# EAGLE schematic MicroMod_Asset_Tracker (EAGLE 9.6.2)

## Sheet 1 of 2
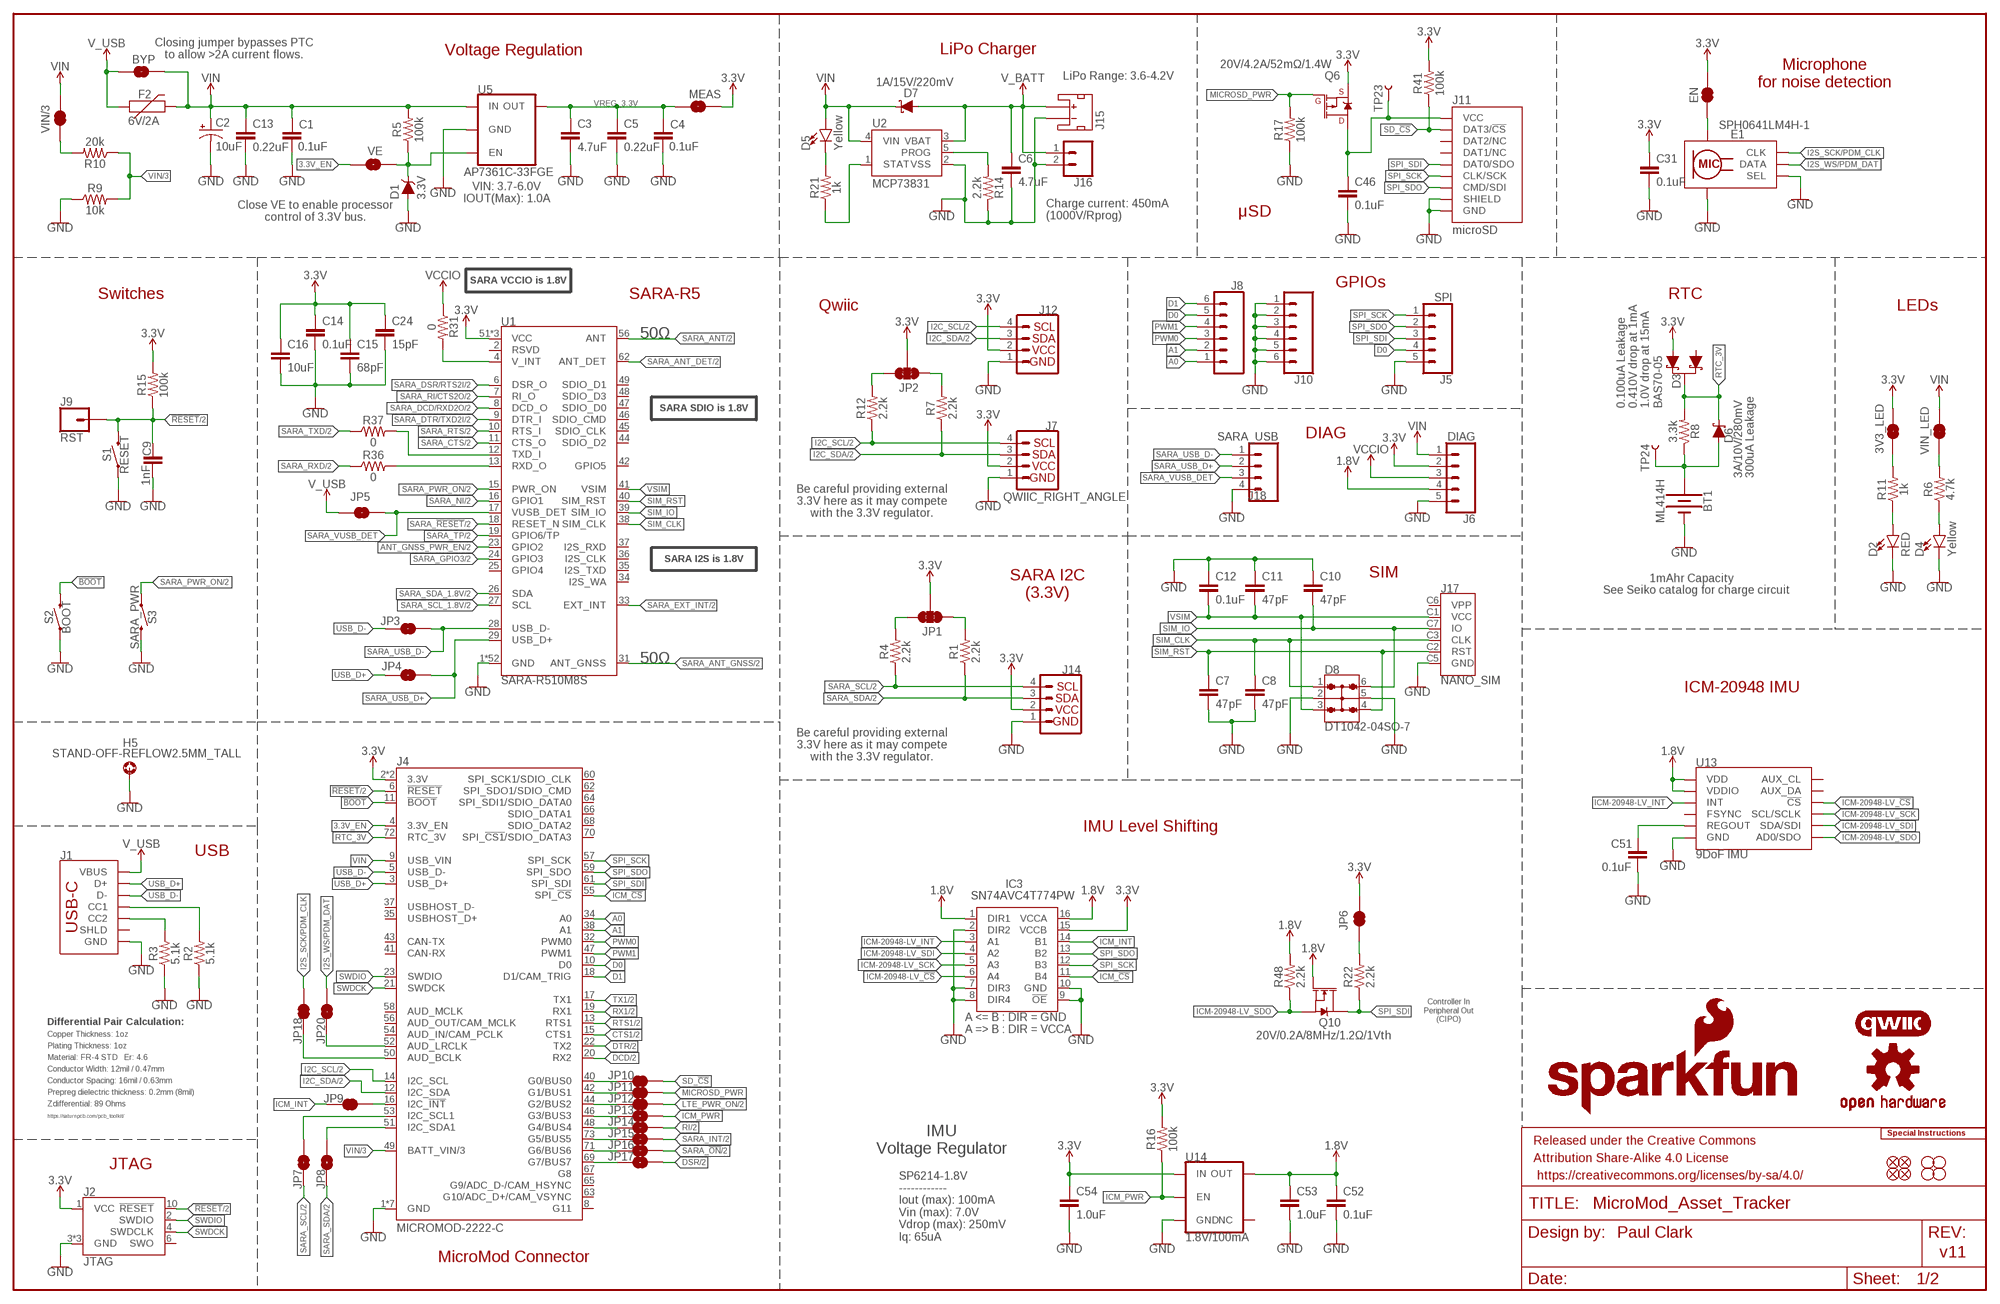
[diagram p0: schematic, sheet 1]

### Parts
3V3_LED  JUMPER-SMT_2_NC_TRACE_SILK  [SMT-JUMPER_2_NC_TRACE_SILK]
BT1  ML414H  ML414H_IV01E_BATTERY  [ML414H_IV01E]
BYP  JUMPER-SMT_2_NO_SILK  [SMT-JUMPER_2_NO_SILK]
C1  0.1uF  0.1UF-0603-25V-(+80/-20%)  [0603]
C2  10uF  10UF-POLAR-EIA3216-16V-10%(TANT)  [EIA3216]
C3  4.7uF  4.7UF-0603-6.3V-(10%)  [0603]
C4  0.1uF  0.1UF-0603-25V-(+80/-20%)  [0603]
C5  0.22uF  0.22UF-0603-25V-10%  [0603]
C6  4.7uF  4.7UF-0603-35V-(20%)  [0603]
C7  47pF  47PF-0603-50V-5%  [0603]
C8  47pF  47PF-0603-50V-5%  [0603]
C9  1nF  1.0NF/1000PF-0603-50V-10%  [0603]
C10  47pF  47PF-0603-50V-5%  [0603]
C11  47pF  47PF-0603-50V-5%  [0603]
C12  0.1uF  0.1UF-0603-25V-5%  [0603]
C13  0.22uF  0.22UF-0603-25V-10%  [0603]
C14  0.1uF  0.1UF-0603-25V-5%  [0603]
C15  68pF  68PF-0603-50V-5%  [0603]
C16  10uF  10UF-0603-6.3V-20%  [0603]
C24  15pF  15PF-0603-50V-5%  [0603]
C31  0.1uF  0.1UF-0603-25V-(+80/-20%)  [0603]
C46  0.1uF  0.1UF-0603-25V-(+80/-20%)  [0603]
C51  0.1uF  0.1UF-0603-25V-5%  [0603]
C52  0.1uF  0.1UF-0603-25V-5%  [0603]
C53  1.0uF  1.0UF-0603-16V-10%-X7R  [0603]
C54  1.0uF  1.0UF-0603-16V-10%-X7R  [0603]
D1  3.3V  DIODE-ZENER-MM3Z3V3T1G  [SOD-323]
D2  RED  LED-RED0603  [LED-0603]
D3  BAS70-05  DIODE-SCHOTTKY-DUAL  [SOT23-3]
D4  Yellow  LED-YELLOW0603  [LED-0603]
D5  Yellow  LED-YELLOW0603  [LED-0603]
D6  3A/10V/280mV  DIODE-SCHOTTKY-BAT60A  [SOD-323]
D7  1A/15V/220mV  DIODE-SCHOTTKY-LSM115JE3  [DO-214BA]
D8  DT1042-04SO-7  TVS_DIODE_ARRAY_4DT1042-04SO-7  [SOT23-6L]
E1  SPH0641LM4H-1  SPH0641LM4H-1_MICROPHONE  [SPH0641LM4H-1_MICROPHONE]
EN  JUMPER-SMT_2_NC_TRACE_SILK  [SMT-JUMPER_2_NC_TRACE_SILK]
F2  6V/2A  PPTC_6V2A  [1210]
FD1  FIDUCIALUFIDUCIAL  [FIDUCIAL-MICRO]
FD2  FIDUCIALUFIDUCIAL  [FIDUCIAL-MICRO]
FD3  FIDUCIALUFIDUCIAL  [FIDUCIAL-MICRO]
FD4  FIDUCIALUFIDUCIAL  [FIDUCIAL-MICRO]
FRAME1  FRAME-LEDGER  [CREATIVE_COMMONS]
H1  STAND-OFF  [STAND-OFF]
H2  STAND-OFF  [STAND-OFF]
H3  STAND-OFF  [STAND-OFF]
H4  STAND-OFF  [STAND-OFF]
H5  STAND-OFF-REFLOW2.5MM_TALL  [STAND-OFF-REFLOW-M2.5]
IC3  SN74AVC4T774PW  [SOP65P640X120-16N]
J1  USB_C_4-LAYER_PADS  [USB-C-16P_4LAYER-PADS]
J2  JTAG  CORTEX_JTAG_DEBUG_MINIMUM_PTH  [2X5-PTH-1.27MM]
J4  MICROMOD-2222-C  [M.2-CONNECTOR-E]
J5  SPI  CONN_05NO_SILK  [1X05_NO_SILK]
J6  DIAG  CONN_05NO_SILK  [1X05_NO_SILK]
J7  QWIIC_RIGHT_ANGLE  QWIIC_CONNECTORJS-1MM  [JST04_1MM_RA]
J8  CONN_06NO_SILK_NO_POP  [1X06_NO_SILK]
J9  !RST!  CONN_01PTH_NO_SILK_YES_STOP  [1X01_NO_SILK]
J10  CONN_06NO_SILK_NO_POP  [1X06_NO_SILK]
J11  microSD  MICRO-SD-SDIOPUSH-PUSH  [MICRO-SD-SOCKET]
J12  I2C_STANDARD_NO_SILK  [1X04_NO_SILK]
J14  I2C_STANDARD_NO_SILK  [1X04_NO_SILK]
J15  JST_2MM_MALE  [JST-2-SMD]
J16  CONN_021X02_NO_SILK  [1X02_NO_SILK]
J17  NANO_SIM  NANO_SIMWURTH  [NANO_SIM_WURTH_693043020611]
J18  SARA_USB  CONN_041X04_NO_SILK  [1X04_NO_SILK]
JP1  JUMPER-SMT_3_2-NC_TRACE_SILK  [SMT-JUMPER_3_2-NC_TRACE_SILK]
JP2  JUMPER-SMT_3_2-NC_TRACE_SILK  [SMT-JUMPER_3_2-NC_TRACE_SILK]
JP3  JUMPER-SMT_2_NO_SILK  [SMT-JUMPER_2_NO_SILK]
JP4  JUMPER-SMT_2_NO_SILK  [SMT-JUMPER_2_NO_SILK]
JP5  JUMPER-SMT_2_NO_SILK  [SMT-JUMPER_2_NO_SILK]
JP6  JUMPER-SMT_2_NC_TRACE_SILK  [SMT-JUMPER_2_NC_TRACE_SILK]
JP7  JUMPER-SMT_2_NO_SILK  [SMT-JUMPER_2_NO_SILK]
JP8  JUMPER-SMT_2_NO_SILK  [SMT-JUMPER_2_NO_SILK]
JP9  JUMPER-SMT_2_NC_TRACE_SILK  [SMT-JUMPER_2_NC_TRACE_SILK]
JP10  JUMPER-SMT_2_NC_TRACE_SILK  [SMT-JUMPER_2_NC_TRACE_SILK]
JP11  JUMPER-SMT_2_NC_TRACE_SILK  [SMT-JUMPER_2_NC_TRACE_SILK]
JP12  JUMPER-SMT_2_NC_TRACE_SILK  [SMT-JUMPER_2_NC_TRACE_SILK]
JP13  JUMPER-SMT_2_NO_SILK  [SMT-JUMPER_2_NO_SILK]
JP14  JUMPER-SMT_2_NO_SILK  [SMT-JUMPER_2_NO_SILK]
JP15  JUMPER-SMT_2_NO_SILK  [SMT-JUMPER_2_NO_SILK]
JP16  JUMPER-SMT_2_NO_SILK  [SMT-JUMPER_2_NO_SILK]
JP17  JUMPER-SMT_2_NO_SILK  [SMT-JUMPER_2_NO_SILK]
JP18  JUMPER-SMT_2_NC_TRACE_SILK  [SMT-JUMPER_2_NC_TRACE_SILK]
JP20  JUMPER-SMT_2_NC_TRACE_SILK  [SMT-JUMPER_2_NC_TRACE_SILK]
LOGO1  SFE_LOGO_NAME_FLAME.1_INCH  [SFE_LOGO_NAME_FLAME_.1]
LOGO2  QWIIC_LOGO_CONNECTOR  [QWIIC_5.5MM]
LOGO3  OSHW-LOGOMINI  [OSHW-LOGO-MINI]
LOGO5  SPECIAL_INSTRUCTIONS-ORDERING  [ORDERING_INSTRUCTIONS]
MEAS  JUMPER-COMBO_2_NC_TRACE  [COMBO-JUMPER_2_NC_TRACE]
Q6  20V/4.2A/52mΩ/1.4W  MOSFET_PCH-DMG2305UX-7  [SOT23-3]
Q10  20V/0.2A/8MHz/1.2Ω/1Vth  MOSFET-NCH-RE1C00UNTL  [SOT-416FL]
R1  2.2k  2.2KOHM-0603-1/10W-1%  [0603]
R2  5.1k  5.1KOHM5.1KOHM-0603-1/10W-1%  [0603]
R3  5.1k  5.1KOHM5.1KOHM-0603-1/10W-1%  [0603]
R4  2.2k  2.2KOHM-0603-1/10W-1%  [0603]
R5  100k  100KOHM-0603-1/10W-1%  [0603]
R6  4.7k  4.7KOHM-0603-1/10W-1%  [0603]
R7  2.2k  2.2KOHM-0603-1/10W-1%  [0603]
R8  3.3k  3.3KOHM-0603-1/10W-1%  [0603]
R9  10k  10KOHM-0603-1/10W-1%  [0603]
R10  20k  20KOHM-0603-1/10W-1%  [0603]
R11  1k  1KOHM-0603-1/10W-1%  [0603]
R12  2.2k  2.2KOHM-0603-1/10W-1%  [0603]
R14  2.2k  2.2KOHM-0603-1/10W-1%  [0603]
R15  100k  100KOHM-0603-1/10W-1%  [0603]
R16  100k  100KOHM-0603-1/10W-1%  [0603]
R17  100k  100KOHM-0603-1/10W-1%  [0603]
R21  1k  1KOHM-0603-1/10W-1%  [0603]
R22  2.2k  2.2KOHM-0603-1/10W-1%  [0603]
R31  0  0OHM-0603-1/10W  [0603]
R36  0  0OHM-0603-1/10W  [0603]
R37  0  0OHM-0603-1/10W  [0603]
R41  100k  100KOHM-0603-1/10W-1%  [0603]
R48  2.2k  2.2KOHM-0603-1/10W-1%  [0603]
S1  RESET  MOMENTARY-SWITCH-SPST-SMD-5.2-TALL-REDUNDANT  [TACTILE_SWITCH_SMD_5.2MM]
S2  BOOT  MOMENTARY-SWITCH-SPST-SMD-5.2-TALL-REDUNDANT  [TACTILE_SWITCH_SMD_5.2MM]
S3  SARA_PWR  MOMENTARY-SWITCH-SPST-SMD-5.2-TALL-REDUNDANT  [TACTILE_SWITCH_SMD_5.2MM]
TP23  TEST-POINT3  [PAD.03X.03]
TP24  TEST-POINT3  [PAD.03X.03]
U1  SARA-R510M8S  [SARA-LGA]
U2  MCP73831  [SOT23-5]
U5  AP7361C-33FGE  AP7361C-33FGEUDFN-8  [UDFN-8]
U13  9DoF IMU  ICM-20948  [QFN24-3X3-ICM-20948]
U14  1.8V/100mA  V_REG_SP6214-1.8V  [SC70]
VE  JUMPER-SMT_2_NO_SILK  [SMT-JUMPER_2_NO_SILK]
VIN/3  JUMPER-SMT_2_NC_TRACE_SILK  [SMT-JUMPER_2_NC_TRACE_SILK]
VIN_LED  JUMPER-SMT_2_NC_TRACE_SILK  [SMT-JUMPER_2_NC_TRACE_SILK]

### Nets
1.8V: C52.1 C53.1 IC3.1(DIR1) IC3.16(VCCA) J6.4 Q10.1(G) R48.2 U13.8(VDDIO) U13.13(VDD) U14.5(OUT)
3.3V: 3V3_LED.2 C14.1 C15.1 C16.1 C24.1 C31.1 C54.1 D3.2(A1) EN.2 IC3.15(VCCB) J2.1(VCC) J4.2(3.3V) J4.74(3.3V) J6.2 J7.2 J12.2 J14.2 JP1.2 JP2.2 JP6.2 MEAS.2 MEAS.4 Q6.2(S) R15.2 R16.2 R41.2 U1.51(VCC) U1.52(VCC) U1.53(VCC) U14.1(IN) ; also sheet 2
3.3V_EN: J4.4(3.3V_EN) VE.1
!BOOT!: J4.11(!BOOT!) S2.3 S2.4
!RESET!: C9.1 J2.10(!RESET) J4.6(!RESET!) J9.1 R15.1 S1.3 S1.4 ; also sheet 2
A0: J4.34(A0) J8.1
A1: J4.38(A1) J8.2
ANT_GNSS_PWR_EN: U1.23(GPIO2) ; also sheet 2
CHG_LED: R21.1 U2.1(STAT)
CTS1: J4.15(CTS1) ; also sheet 2
D0: J4.10(D0) J5.4 J8.5
D1: J4.18(D1/CAM_TRIG) J8.6
DCD: J4.20(RX2) ; also sheet 2
DSR: JP17.2 ; also sheet 2
DTR: J4.22(TX2) ; also sheet 2
G0: J4.40(G0/BUS0) JP10.1
G1: J4.42(G1/BUS1) JP11.1
G2: J4.44(G2/BUS2) JP12.1
G3: J4.46(G3/BUS3) JP13.1
G4: J4.48(G4/BUS4) JP14.1
G5: J4.73(G5/BUS5) JP15.1
G6: J4.71(G6/BUS6) JP16.1
G7: J4.69(G7/BUS7) JP17.1
GND: BT1.- C1.2 C2.- C3.2 C4.2 C5.2 C6.2 C7.2 C8.2 C9.2 C10.1 C11.1 C12.1 C13.2 C14.2 C15.2 C16.2 C24.2 C31.2 C46.2 C51.2 C52.2 C53.2 C54.2 D1.A D2.C D4.C D8.2 D8.5 E1.2(SEL) E1.3(GND) E1.6(GND) E1.7(GND) E1.8(GND) H5.1 IC3.2(DIR2) IC3.7(DIR3) IC3.8(DIR4) IC3.9(!OE) IC3.10(GND) J1.GND J1.GND2(GND) J2.3(GND) J2.5(GND) J2.9(GND) J4.1(GND) J4.7(GND) J4.33(GND) J4.36(GND) J4.39(GND) J4.45(GND) J4.75(GND) J5.5 J6.5 J7.1 J10.1 J10.2 J10.3 J10.4 J10.5 J10.6 J11.CD1(SHIELD) J11.GND J11.GND1(GND) J11.GND3(GND) J12.1 J14.1 J15.1(-) J16.2 J17.C5(GND) J18.4 R2.1 R3.1 R9.1 R14.1 R17.1 S1.1 S1.2 S2.1 S2.2 S3.3 S3.4 U1.1(GND) U1.3(GND) U1.5(GND) U1.14(GND) U1.20(GND) U1.21(GND) U1.22(GND) U1.30(GND) U1.32(GND) U1.43(GND) U1.50(GND) U1.54(GND) U1.55(GND) U1.57(GND) U1.58(GND) U1.59(GND) U1.60(GND) U1.61(GND) U1.63(GND) U1.64(GND) U1.65(GND) U1.66(GND) U1.67(GND) U1.68(GND) U1.69(GND) U1.70(GND) U1.71(GND) U1.72(GND) U1.73(GND) U1.74(GND) U1.75(GND) U1.76(GND) U1.77(GND) U1.78(GND) U1.79(GND) U1.80(GND) U1.81(GND) U1.82(GND) U1.83(GND) U1.84(GND) U1.85(GND) U1.86(GND) U1.87(GND) U1.88(GND) U1.89(GND) U1.90(GND) U1.91(GND) U1.92(GND) U1.93(GND) U1.94(GND) U1.95(GND) U1.96(GND) U2.2(VSS) U5.4(GND) U5.EP(GND) U13.18(GND) U13.20(GND) U14.2(GND) ; also sheet 2
I2C_SCL: J4.14(I2C_SCL) J7.4 J12.4 R12.1 ; also sheet 2
I2C_SDA: J4.12(I2C_SDA) J7.3 J12.3 R7.1 ; also sheet 2
I2S_SCK/PDM_CLK: E1.4(CLK) JP18.2
I2S_WS/PDM_DAT: E1.1(DATA) JP20.2
ICM-20948-LV_!CS!: IC3.6(A4) U13.22(!CS)
ICM-20948-LV_INT: IC3.3(A1) U13.12(INT)
ICM-20948-LV_SCK: IC3.5(A3) U13.23(SCL/SCLK)
ICM-20948-LV_SDI: IC3.4(A2) U13.24(SDA/SDI)
ICM-20948-LV_SDO: Q10.2(S) R48.1 U13.9(AD0/SDO)
ICM_!CS!: IC3.11(B4) J4.55(SPI_!CS!)
ICM_INT: IC3.14(B1) JP9.1
ICM_PWR: JP13.2 R16.1 U14.3(EN)
LTE_PWR_ON: JP12.2 ; also sheet 2
MICROSD_PWR: JP11.2 Q6.1(G) R17.2
N$1: R6.2 VIN_LED.1
N$2: JP1.3 R4.2
N$3: JP1.1 R1.2
N$4: E1.5(VDD) EN.1
N$5: J4.53(I2C_SCL1) JP7.2
N$6: 3V3_LED.1 R11.2
N$7: D2.A R11.1
N$8: D4.A R6.1
N$9: JP2.3 R12.2
N$10: J1.A5(CC1) R2.2
N$11: J1.B5(CC2) R3.2
N$12: D1.C R5.1 U5.5(EN) VE.2
N$13: JP2.1 R7.2
N$14: BT1.+ D6.A R8.1 TP24.P$1
N$17: J4.51(I2C_SDA1) JP8.2
N$18: R10.2 VIN/3.1
N$19: J4.16(I2C_!INT!) JP9.2
N$20: R14.2 U2.5(PROG)
N$21: D5.C R21.2
N$29: JP6.1 R22.2
N$30: C51.1 U13.10(REGOUT)
N$31: R31.2 U1.4(V_INT)
N$38: R36.2 U1.13(RXD_O)
N$39: R37.2 U1.12(TXD_I)
N$51: J4.52(AUD_LRCLK) JP20.1
N$52: J4.50(AUD_BCLK) JP18.1
PWM0: J4.32(PWM0) J8.3
PWM1: J4.47(PWM1) J8.4
RI: JP14.2 ; also sheet 2
RTC_3V: D3.3(C) D6.C J4.72(RTC_3V) R8.2
RTS1: J4.13(RTS1) ; also sheet 2
RX1: J4.19(RX1) ; also sheet 2
SARA_!ON!: JP16.2 ; also sheet 2
SARA_!RESET!: U1.18(RESET_N) ; also sheet 2
SARA_ANT: U1.56(ANT) ; also sheet 2
SARA_ANT_DET: U1.62(ANT_DET) ; also sheet 2
SARA_ANT_GNSS: U1.31(ANT_GNSS) ; also sheet 2
SARA_CTS: U1.11(CTS_O) ; also sheet 2
SARA_DCD/RXD2O: U1.8(DCD_O) ; also sheet 2
SARA_DSR/RTS2I: U1.6(DSR_O) ; also sheet 2
SARA_DTR/TXD2I: U1.9(DTR_I) ; also sheet 2
SARA_EXT_INT: U1.33(EXT_INT) ; also sheet 2
SARA_GPIO3: U1.24(GPIO3) ; also sheet 2
SARA_INT: JP15.2 ; also sheet 2
SARA_NI: U1.16(GPIO1) ; also sheet 2
SARA_PWR_ON: S3.1 S3.2 U1.15(PWR_ON) ; also sheet 2
SARA_RI/CTS2O: U1.7(RI_O) ; also sheet 2
SARA_RTS: U1.10(RTS_I) ; also sheet 2
SARA_RXD: R36.1 ; also sheet 2
SARA_SCL: J14.4 JP7.1 R4.1 ; also sheet 2
SARA_SCL_1.8V: U1.27(SCL) ; also sheet 2
SARA_SDA: J14.3 JP8.1 R1.1 ; also sheet 2
SARA_SDA_1.8V: U1.26(SDA) ; also sheet 2
SARA_TP: U1.19(GPIO6/TP) ; also sheet 2
SARA_TXD: R37.1 ; also sheet 2
SARA_USB_D+: J18.2 JP4.2 U1.29(USB_D+)
SARA_USB_D-: J18.1 JP3.2 U1.28(USB_D-)
SARA_VUSB_DET: J18.3 JP5.2 U1.17(VUSB_DET)
SD_!CS!: J11.CS/DAT3(DAT3/!CS!) JP10.2 R41.1
SD_PWR: C46.1 J11.VCC Q6.3(D) TP23.P$1
SIM_CLK: C8.1 D8.1 J17.C3(CLK) U1.38(SIM_CLK)
SIM_IO: C10.2 D8.6 J17.C7(IO) U1.39(SIM_IO)
SIM_RST: C7.1 D8.4 J17.C2(RST) U1.40(SIM_RST)
SPI_SCK: IC3.12(B3) J4.57(SPI_SCK) J5.1 J11.SCLK(CLK/SCK)
SPI_SDI: J4.61(SPI_SDI) J5.3 J11.DO/DAT0(DAT0/SDO) Q10.3(D) R22.1
SPI_SDO: IC3.13(B2) J4.59(SPI_SDO) J5.2 J11.DI/CMD(CMD/SDI)
SWDCK: J2.4(SWDCLK) J4.21(SWDCK)
SWDIO: J2.2(SWDIO) J4.23(SWDIO)
TX1: J4.17(TX1) ; also sheet 2
USB_D+: J1.A6(D+) J1.B6(D+) J4.3(USB_D+) JP4.1
USB_D-: J1.A7(D-) J1.B7(D-) J4.5(USB_D-) JP3.1
V_BATT: C6.1 D7.A J15.2(+) J16.1 U2.3(VBAT) ; also sheet 2
V_USB: BYP.1 F2.1 J1.VBUS1(VBUS) J1.VBUS2(VBUS) JP5.1
VCCIO: J6.3 R31.1 ; also sheet 2
VIN: BYP.2 C1.1 C2.+ C13.1 D5.A D7.C F2.2 J4.9(USB_VIN) J6.1 R5.2 U2.4(VIN) U5.8(IN) VIN/3.2 VIN_LED.2 ; also sheet 2
VIN/3: J4.49(BATT_VIN/3) R9.2 R10.1
VREG_3.3V: C3.1 C4.1 C5.1 MEAS.1 MEAS.3 U5.1(OUT)
VSIM: C11.2 C12.2 D8.3 J17.C1(VCC) U1.41(VSIM)
Unconnected: D3.1(A) J1.SHLD1(SHLD) J1.SHLD2(SHLD) J1.SHLD3(SHLD) J1.SHLD4(SHLD) J2.6(SWO) J4.8(G11) J4.35(USBHOST_D+) J4.37(USBHOST_D-) J4.41(CAN-RX) J4.43(CAN-TX) J4.54(AUD_IN/CAM_PCLK) J4.56(AUD_OUT/CAM_MCLK) J4.58(AUD_MCLK) J4.60(SPI_SCK1/SDIO_CLK) J4.62(SPI_SDO1/SDIO_CMD) J4.63(G10/ADC_D+/CAM_VSYNC) J4.64(SPI_SDI1/SDIO_DATA0) J4.65(G9/ADC_D-/CAM_HSYNC) J4.66(SDIO_DATA1) J4.67(G8) J4.68(SDIO_DATA2) J4.70(SPI_!CS1!/SDIO_DATA3) J11.DAT1(DAT1/NC) J11.DAT2(DAT2/NC) J15.NC1(PAD1) J15.NC2(PAD2) J17.C6(VPP) U1.2(RSVD) U1.25(GPIO4) U1.34(I2S_WA) U1.35(I2S_TXD) U1.36(I2S_CLK) U1.37(I2S_RXD) U1.42(GPIO5) U1.44(SDIO_D2) U1.45(SDIO_CLK) U1.46(SDIO_CMD) U1.47(SDIO_D0) U1.48(SDIO_D3) U1.49(SDIO_D1) U13.7(AUX_CL) U13.11(FSYNC) U13.21(AUX_DA) U14.4(NC)

### Notes on the sheet
- Closing jumper bypasses PTC
  to allow >2A current flows.
- Voltage Regulation | LiPo Charger
- LiPo Range: 3.6-4.2V
- Microphone
  for noise detection
- VIN: 3.7-6.0V
  IOUT(Max): 1.0A
- Charge current: 450mA
  (1000V/Rprog)
- Close VE to enable processor
  control of 3.3V bus.
- μSD
- SARA VCCIO is 1.8V
- GPIOs
- Switches | SARA-R5 | RTC
- Qwiic | LEDs
- 50Ω
- SARA SDIO is 1.8V
- 0.100uA Leakage
  0.410V drop at 1mA
  1.0V drop at 15mA
- DIAG
- 300uA Leakage
- Be careful providing external
  3.3V here as it may compete
  with the 3.3V regulator.
- SARA I2S is 1.8V
- SIM
- 1mAhr Capacity
- SARA I2C
  (3.3V)
- See Seiko catalog for charge circuit
- 50Ω
- ICM-20948 IMU
- Be careful providing external
  3.3V here as it may compete
  with the 3.3V regulator.
- IMU Level Shifting
- USB
- Controller In
  Peripheral Out
  (CIPO)
- Differential Pair Calculation:
- Copper Thickness: 1oz
- Plating Thickness: 1oz
- Material: FR-4 STD   Er: 4.6
- Conductor Width: 12mil / 0.47mm
- Conductor Spacing: 16mil / 0.63mm
- Prepreg dielectric thickness: 0.2mm (8mil)
- Zdifferential: 89 Ohms
- https://saturnpcb.com/pcb_toolkit/
- IMU
  Voltage Regulator
- JTAG
- SP6214-1.8V
  ------------
  Iout (max): 100mA 
  Vin (max): 7.0V
  Vdrop (max): 250mV
  Iq: 65uA
- Paul Clark
- MicroMod Connector | v11

## Sheet 2 of 2
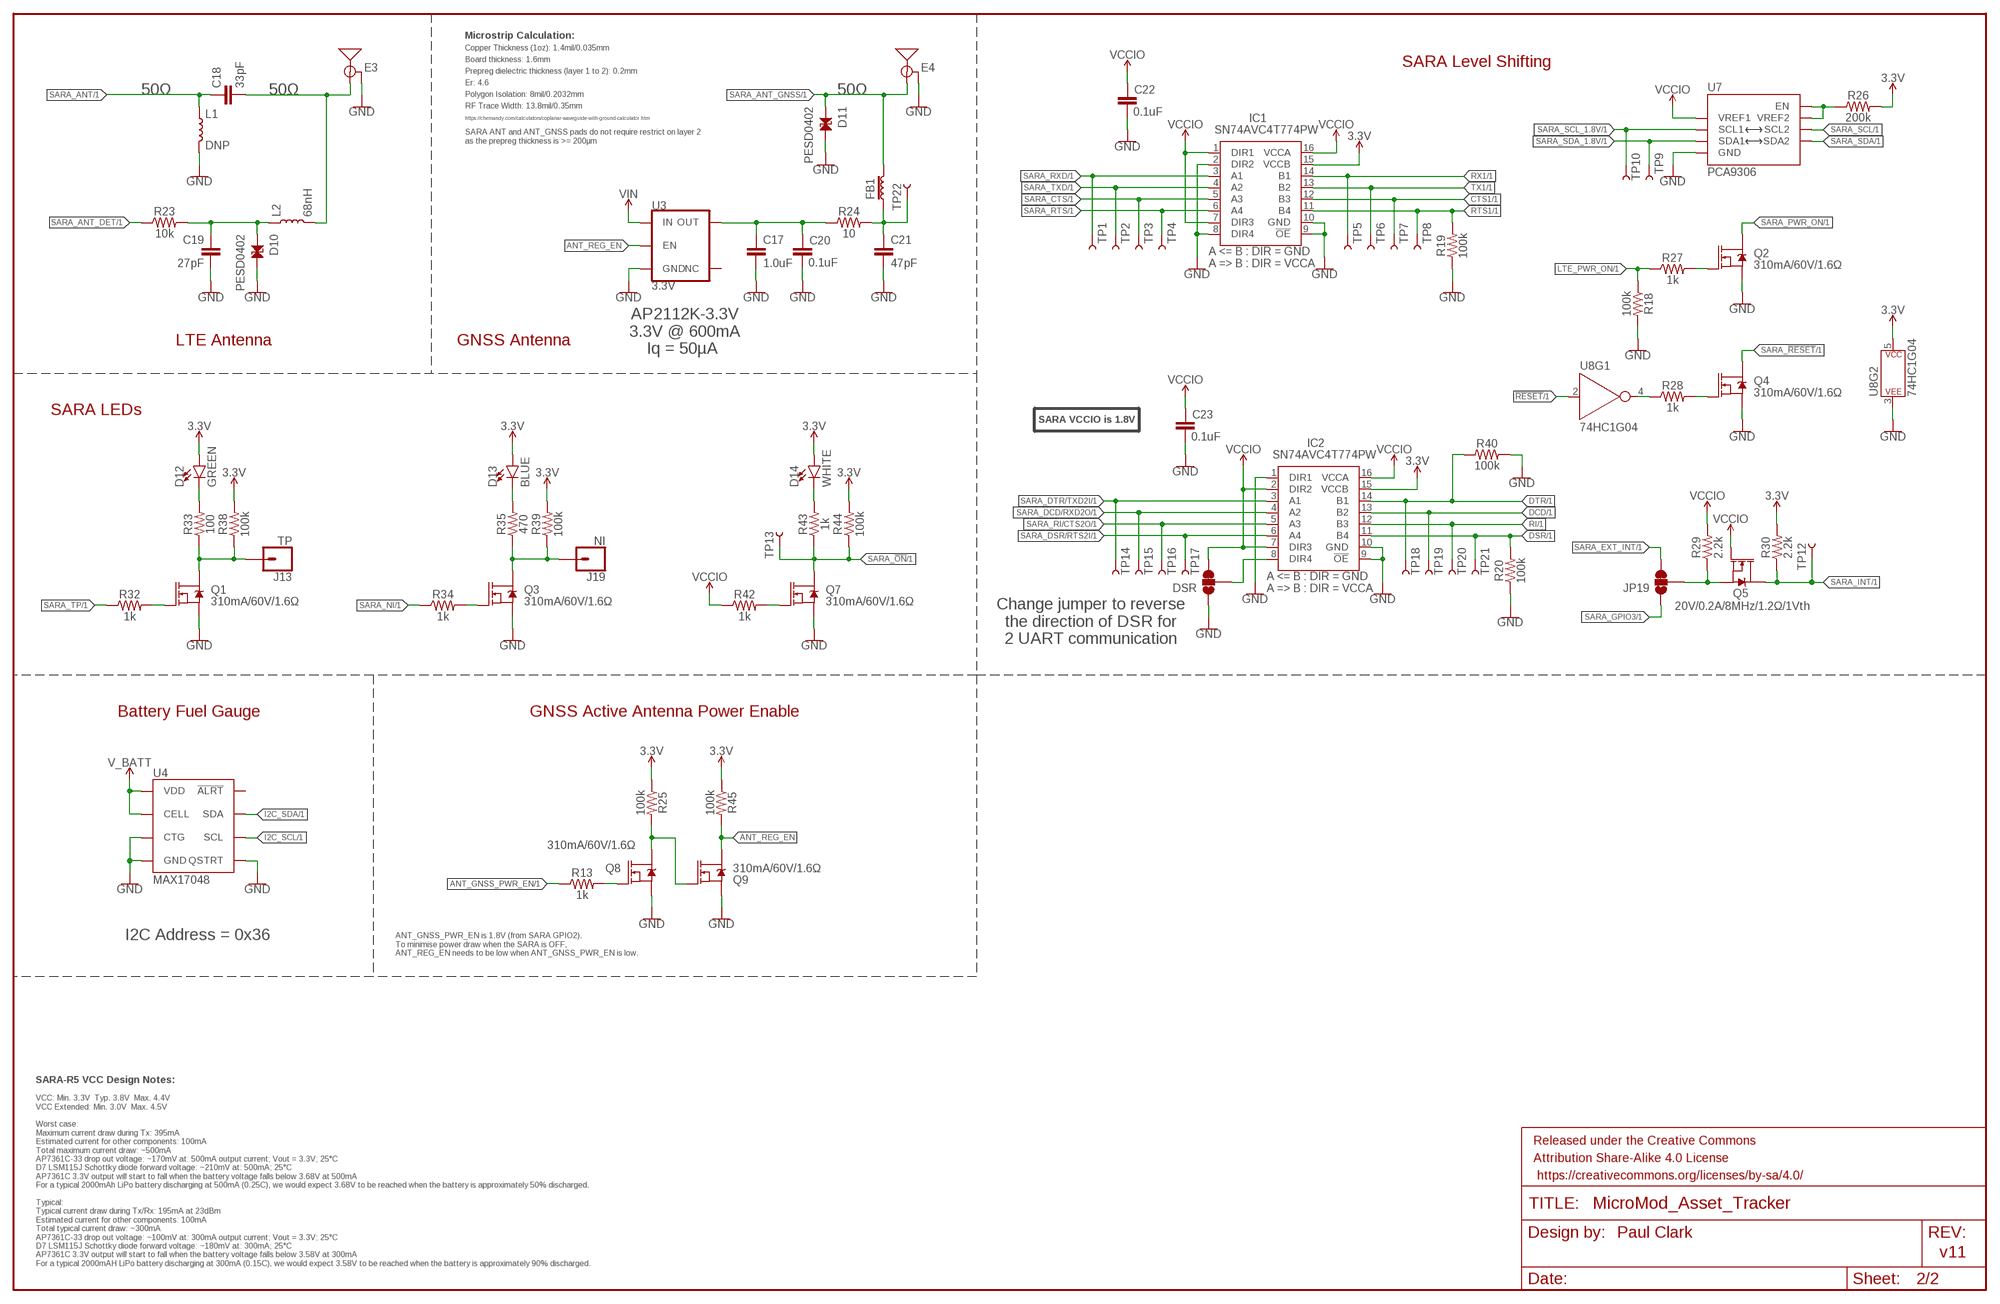
[diagram p1: schematic, sheet 2]

### Parts
C17  1.0uF  1.0UF-0603-16V-10%  [0603]
C18  33pF  33PF-0402-25V-5%-X7R  [0402]
C19  27pF  27PF-0402-25V-5%-X7R  [0402]
C20  0.1uF  0.1UF-0603-25V-(+80/-20%)  [0603]
C21  47pF  47PF-0603-50V-5%  [0603]
C22  0.1uF  0.1UF-0603-25V-(+80/-20%)  [0603]
C23  0.1uF  0.1UF-0603-25V-(+80/-20%)  [0603]
D10  PESD0402  [0402]
D11  PESD0402  [0402]
D12  GREEN  LED-GREEN0603  [LED-0603]
D13  BLUE  LED-BLUE0603  [LED-0603]
D14  WHITE  LED-WHITE0603  [LED-0603]
DSR  JUMPER-SMT_3_1-NC_TRACE_SILK  [SMT-JUMPER_3_1-NC_TRACE_SILK]
E3  ANTENNA-SMA-GROUNDEDEDGE_SMA_SMD  [SMA-EDGE-SMD]
E4  ANTENNA-SMA-GROUNDEDEDGE_SMA_SMD  [SMA-EDGE-SMD]
FB1  30Ω/1.8A  FERRITE_BEAD-0603  [0603]
FRAME2  FRAME-LEDGER  [CREATIVE_COMMONS]
IC1  SN74AVC4T774PW  [SOP65P640X120-16N]
IC2  SN74AVC4T774PW  [SOP65P640X120-16N]
J13  TP  CONN_01PTH_NO_SILK_YES_STOP  [1X01_NO_SILK]
J19  NI  CONN_01PTH_NO_SILK_YES_STOP  [1X01_NO_SILK]
JP19  JUMPER-SMT_3_1-NC_TRACE_SILK  [SMT-JUMPER_3_1-NC_TRACE_SILK]
L1  DNP  INDUCTOR_DNP-0402  [0402_COILCRAFT]
L2  68nH  68NH-0402  [0402_COILCRAFT]
Q1  310mA/60V/1.6Ω  MOSFET-NCH-2N7002PW  [SOT323]
Q2  310mA/60V/1.6Ω  MOSFET-NCH-2N7002PW  [SOT323]
Q3  310mA/60V/1.6Ω  MOSFET-NCH-2N7002PW  [SOT323]
Q4  310mA/60V/1.6Ω  MOSFET-NCH-2N7002PW  [SOT323]
Q5  20V/0.2A/8MHz/1.2Ω/1Vth  MOSFET-NCH-RE1C00UNTL  [SOT-416FL]
Q7  310mA/60V/1.6Ω  MOSFET-NCH-2N7002PW  [SOT323]
Q8  310mA/60V/1.6Ω  MOSFET-NCH-2N7002PW  [SOT323]
Q9  310mA/60V/1.6Ω  MOSFET-NCH-2N7002PW  [SOT323]
R13  1k  1KOHM-0603-1/10W-1%  [0603]
R18  100k  100KOHM-0603-1/10W-1%  [0603]
R19  100k  100KOHM-0603-1/10W-1%  [0603]
R20  100k  100KOHM-0603-1/10W-1%  [0603]
R23  10k  10KOHM-0603-1/10W-1%  [0603]
R24  10  10OHM-0603-1/10W-1%  [0603]
R25  100k  100KOHM-0603-1/10W-1%  [0603]
R26  200k  200KOHM-0603-1/10W-1%  [0603]
R27  1k  1KOHM-0603-1/10W-1%  [0603]
R28  1k  1KOHM-0603-1/10W-1%  [0603]
R29  2.2k  2.2KOHM-0603-1/10W-1%  [0603]
R30  2.2k  2.2KOHM-0603-1/10W-1%  [0603]
R32  1k  1KOHM-0603-1/10W-1%  [0603]
R33  100  100OHM-0603-1/10W-1%  [0603]
R34  1k  1KOHM-0603-1/10W-1%  [0603]
R35  470  470OHM-0603-1/10W-1%  [0603]
R38  100k  100KOHM-0603-1/10W-1%  [0603]
R39  100k  100KOHM-0603-1/10W-1%  [0603]
R40  100k  100KOHM-0603-1/10W-1%  [0603]
R42  1k  1KOHM-0603-1/10W-1%  [0603]
R43  1k  1KOHM-0603-1/10W-1%  [0603]
R44  100k  100KOHM-0603-1/10W-1%  [0603]
R45  100k  100KOHM-0603-1/10W-1%  [0603]
TP1  TEST-POINT3  [PAD.03X.03]
TP2  TEST-POINT3  [PAD.03X.03]
TP3  TEST-POINT3  [PAD.03X.03]
TP4  TEST-POINT3  [PAD.03X.03]
TP5  TEST-POINT3  [PAD.03X.03]
TP6  TEST-POINT3  [PAD.03X.03]
TP7  TEST-POINT3  [PAD.03X.03]
TP8  TEST-POINT3  [PAD.03X.03]
TP9  TEST-POINT3  [PAD.03X.03]
TP10  TEST-POINT3  [PAD.03X.03]
TP12  TEST-POINT3  [PAD.03X.03]
TP13  TEST-POINT3  [PAD.03X.03]
TP14  TEST-POINT3  [PAD.03X.03]
TP15  TEST-POINT3  [PAD.03X.03]
TP16  TEST-POINT3  [PAD.03X.03]
TP17  TEST-POINT3  [PAD.03X.03]
TP18  TEST-POINT3  [PAD.03X.03]
TP19  TEST-POINT3  [PAD.03X.03]
TP20  TEST-POINT3  [PAD.03X.03]
TP21  TEST-POINT3  [PAD.03X.03]
TP22  TEST-POINT3  [PAD.03X.03]
U3  3.3V  V_REG_AP2112K-3.3V  [SOT23-5]
U4  MAX17048  MAX17048DFN8  [DFN-8]
U7  PCA9306  PCA9306VSSOP_8PIN  [VSSOP_8PIN]
U8  74HC1G04  [SOT353]

### Nets
3.3V: D12.A D13.A D14.A IC1.15(VCCB) IC2.15(VCCB) R25.1 R26.2 R30.2 R38.2 R39.2 R44.2 R45.1 U8.5(P$V+) ; also sheet 1
!RESET!: U8.2(A) ; also sheet 1
ANT_GNSS_PWR_EN: R13.1 ; also sheet 1
ANT_REG_EN: Q9.3(D) R45.2 U3.3(EN)
CTS1: IC1.12(B3) TP7.P$1 ; also sheet 1
DCD: IC2.13(B2) TP19.P$1 ; also sheet 1
DSR: IC2.11(B4) R20.2 TP21.P$1 ; also sheet 1
DTR: IC2.14(B1) R40.1 TP18.P$1 ; also sheet 1
GND: C17.2 C19.2 C20.2 C21.2 C22.2 C23.2 D10.2 D11.2 DSR.1 E3.GND@0(GND) E3.GND@1(GND) E4.GND@0(GND) E4.GND@1(GND) IC1.2(DIR2) IC1.8(DIR4) IC1.9(!OE) IC1.10(GND) IC2.1(DIR1) IC2.9(!OE) IC2.10(GND) L1.P$2 Q1.2(S) Q2.2(S) Q3.2(S) Q4.2(S) Q7.2(S) Q8.2(S) Q9.2(S) R18.2 R19.1 R20.1 R40.2 U3.2(GND) U4.1(CTG) U4.4(GND) U4.6(QSTRT) U4.9(GND) U7.P1(GND) U8.3(P$V-) ; also sheet 1
I2C_SCL: U4.7(SCL) ; also sheet 1
I2C_SDA: U4.8(SDA) ; also sheet 1
LTE_PWR_ON: R18.1 R27.1 ; also sheet 1
N$15: C18.2 E3.SIG(SIGNAL) L2.P$2
N$16: C19.1 D10.1 L2.P$1 R23.2
N$22: R26.1 U7.P7(VREF2) U7.P8(EN)
N$23: DSR.2 IC2.8(DIR4)
N$24: C17.1 C20.1 R24.1 U3.5(OUT)
N$25: C21.1 FB1.1 R24.2 TP22.P$1
N$26: Q2.1(G) R27.2
N$27: Q4.1(G) R28.2
N$28: R28.1 U8.4(Y)
N$32: Q1.1(G) R32.2
N$33: J13.1 Q1.3(D) R33.1 R38.1
N$34: D12.C R33.2
N$35: Q3.1(G) R34.2
N$36: J19.1 Q3.3(D) R35.1 R39.1
N$37: D13.C R35.2
N$40: Q8.1(G) R13.2
N$42: Q8.3(D) Q9.1(G) R25.2
N$43: JP19.2 Q5.2(S) R29.1
N$47: Q7.1(G) R42.2
N$49: D14.C R43.2
RI: IC2.12(B3) TP20.P$1 ; also sheet 1
RTS1: IC1.11(B4) R19.2 TP8.P$1 ; also sheet 1
RX1: IC1.14(B1) TP5.P$1 ; also sheet 1
SARA_!ON!: Q7.3(D) R43.1 R44.1 TP13.P$1 ; also sheet 1
SARA_!RESET!: Q4.3(D) ; also sheet 1
SARA_ANT: C18.1 L1.P$1 ; also sheet 1
SARA_ANT_DET: R23.1 ; also sheet 1
SARA_ANT_GNSS: D11.1 E4.SIG(SIGNAL) FB1.2 ; also sheet 1
SARA_CTS: IC1.5(A3) TP3.P$1 ; also sheet 1
SARA_DCD/RXD2O: IC2.4(A2) TP15.P$1 ; also sheet 1
SARA_DSR/RTS2I: IC2.6(A4) TP17.P$1 ; also sheet 1
SARA_DTR/TXD2I: IC2.3(A1) TP14.P$1 ; also sheet 1
SARA_EXT_INT: JP19.3 ; also sheet 1
SARA_GPIO3: JP19.1 ; also sheet 1
SARA_INT: Q5.3(D) R30.1 TP12.P$1 ; also sheet 1
SARA_NI: R34.1 ; also sheet 1
SARA_PWR_ON: Q2.3(D) ; also sheet 1
SARA_RI/CTS2O: IC2.5(A3) TP16.P$1 ; also sheet 1
SARA_RTS: IC1.6(A4) TP4.P$1 ; also sheet 1
SARA_RXD: IC1.3(A1) TP1.P$1 ; also sheet 1
SARA_SCL: U7.P6(SCL2) ; also sheet 1
SARA_SCL_1.8V: TP10.P$1 U7.P3(SCL1) ; also sheet 1
SARA_SDA: U7.P5(SDA2) ; also sheet 1
SARA_SDA_1.8V: TP9.P$1 U7.P4(SDA1) ; also sheet 1
SARA_TP: R32.1 ; also sheet 1
SARA_TXD: IC1.4(A2) TP2.P$1 ; also sheet 1
TX1: IC1.13(B2) TP6.P$1 ; also sheet 1
V_BATT: U4.2(CELL) U4.3(VDD) ; also sheet 1
VCCIO: C22.1 C23.1 DSR.3 IC1.1(DIR1) IC1.7(DIR3) IC1.16(VCCA) IC2.2(DIR2) IC2.7(DIR3) IC2.16(VCCA) Q5.1(G) R29.2 R42.1 U7.P2(VREF1) ; also sheet 1
VIN: U3.1(IN) ; also sheet 1
Unconnected: U3.4(NC) U4.5(!ALRT)

### Notes on the sheet
- Microstrip Calculation:
- Copper Thickness (1oz): 1.4mil/0.035mm
- Board thickness: 1.6mm | SARA Level Shifting
- Prepreg dielectric thickness (layer 1 to 2): 0.2mm
- Er: 4.6
- 50Ω | 50Ω | Polygon Isolation: 8mil/0.2032mm | 50Ω
- RF Trace Width: 13.8mil/0.35mm
- https://chemandy.com/calculators/coplanar-waveguide-with-ground-calculator.htm
- SARA ANT and ANT_GNSS pads do not require restrict on layer 2
  as the prepreg thickness is >= 200µm
- AP2112K-3.3V
  3.3V @ 600mA
  Iq = 50µA
- LTE Antenna | GNSS Antenna
- SARA LEDs
- SARA VCCIO is 1.8V
- Change jumper to reverse
  the direction of DSR for
  2 UART communication
- Battery Fuel Gauge | GNSS Active Antenna Power Enable
- I2C Address = 0x36
- ANT_GNSS_PWR_EN is 1.8V (from SARA GPIO2).
  To minimise power draw when the SARA is OFF,
  ANT_REG_EN needs to be low when ANT_GNSS_PWR_EN is low.
- SARA-R5 VCC Design Notes:
- VCC: Min. 3.3V  Typ. 3.8V  Max. 4.4V
  VCC Extended: Min. 3.0V  Max. 4.5V
  
  Worst case:
  Maximum current draw during Tx: 395mA
  Estimated current for other components: 100mA
  Total maximum current draw: ~500mA
  AP7361C-33 drop out voltage: ~170mV at: 500mA output current; Vout = 3.3V; 25°C
  D7 LSM115J Schottky diode forward voltage: ~210mV at: 500mA; 25°C
  AP7361C 3.3V output will start to fall when the battery voltage falls below 3.68V at 500mA
  For a typical 2000mAh LiPo battery discharging at 500mA (0.25C), we would expect 3.68V to be reached when the battery is approximately 50% discharged.
  
  Typical:
  Typical current draw during Tx/Rx: 195mA at 23dBm
  Estimated current for other components: 100mA
  Total typical current draw: ~300mA
  AP7361C-33 drop out voltage: ~100mV at: 300mA output current; Vout = 3.3V; 25°C
  D7 LSM115J Schottky diode forward voltage: ~180mV at: 300mA; 25°C
  AP7361C 3.3V output will start to fall when the battery voltage falls below 3.58V at 300mA
  For a typical 2000mAH LiPo battery discharging at 300mA (0.15C), we would expect 3.58V to be reached when the battery is approximately 90% discharged.
- Paul Clark
- v11

## Library data of the parts
3V3_LED EN JP6 JP9-JP12 JP18 JP20 VIN/3 VIN_LED = SparkFun-Jumpers:JUMPER-SMT_2_NC_TRACE: Normally closed trace jumper This jumper has a trace between two pads so it's normally closed (NC). Use a razor knife to open the connection. For best results follow the IPC guidelines for cutting traces: Cutout at least 0.063 mm (0.005 in). Remove all loose material to clean up the cut area. Seal the cut with an approved epoxy. Reapply solder to reclose the connection.
BT1 = SparkFun-Batteries:ML414H_IV01E_BATTERY: SEIKO ML414H-IV01E Reflowable Lithium Battery ML414H is a rechargeable, coin type battery with features such as Pb-free reflowable (Peak temperature: 260 C) and high temperature heat resistance. Battery Characteristics: 3.1V max voltage Voff is 2V 1mAH 3k series resistor with battery 72 hour charge time from 2.0-3.1V 2.3-2.8V initial charge; PROD_ID: BATT-14267
BYP JP3-JP5 JP7 JP8 JP13-JP17 VE = SparkFun-Jumpers:JUMPER-SMT_2_NO: Normally open jumper This jumper has two pads in close proximity to each other. Apply solder to close the connection. Round pads are easier to solder for beginners, but are a lot larger. SparkFun Product that uses the round pads: SparkFun EL Sequencer <https://www.sparkfun.com/products/12781>
C1 C4 C20 C22 C23 C31 C46 = SparkFun-Capacitors:0.1UF: 0.1µF ceramic capacitors A capacitor is a passive two-terminal electrical component used to store electrical energy temporarily in an electric field.; PROD_ID: CAP-00810
C2 = SparkFun-Capacitors:10UF-POLAR: 10.0µF polarized capacitors A capacitor is a passive two-terminal electrical component used to store electrical energy temporarily in an electric field.; PROD_ID: CAP-00811
C3 = SparkFun-Capacitors:4.7UF: 4.7µF ceramic capacitors A capacitor is a passive two-terminal electrical component used to store electrical energy temporarily in an electric field.; PROD_ID: CAP-08280
C5 C13 = SparkFun-Capacitors:0.22UF: 0.22µF ceramic capacitors A capacitor is a passive two-terminal electrical component used to store electrical energy temporarily in an electric field.; PROD_ID: CAP-07822
C6 = SparkFun-Capacitors:4.7UF: 4.7µF ceramic capacitors A capacitor is a passive two-terminal electrical component used to store electrical energy temporarily in an electric field.; PROD_ID: CAP-14106
C7 C8 C10 C11 C21 = SparkFun-Capacitors:47PF: 47pF ceramic capacitors A capacitor is a passive two-terminal electrical component used to store electrical energy temporarily in an electric field.; PROD_ID: CAP-08913
C9 = SparkFun-Capacitors:1.0NF/1000PF: 1nF/1,000pF ceramic capacitors A capacitor is a passive two-terminal electrical component used to store electrical energy temporarily in an electric field.; PROD_ID: CAP-07886
C12 C14 C51 C52 = SparkFun-Capacitors:0.1UF: 0.1µF ceramic capacitors A capacitor is a passive two-terminal electrical component used to store electrical energy temporarily in an electric field.; PROD_ID: CAP-08604
C15 = SparkFun-Capacitors:68PF: 68pF ceramic capacitors A capacitor is a passive two-terminal electrical component used to store electrical energy temporarily in an electric field.; PROD_ID: CAP-14092
C16 = SparkFun-Capacitors:10UF: 10.0µF ceramic capacitors A capacitor is a passive two-terminal electrical component used to store electrical energy temporarily in an electric field.; PROD_ID: CAP-11015
C17 = SparkFun-Capacitors:1.0UF: 1µF ceramic capacitors A capacitor is a passive two-terminal electrical component used to store electrical energy temporarily in an electric field.; PROD_ID: CAP-00868
C18 = New_Parts:33PF: 33pF ceramic capacitors A capacitor is a passive two-terminal electrical component used to store electrical energy temporarily in an electric field.; DIGIKEY_PART: 490-5936-1-ND; MANUFACTURER: Murata; MANU_PART: GRM1555C1H330JA; PROD_ID: CAP-15358
C19 = New_Parts:27PF: 27pF ceramic capacitors A capacitor is a passive two-terminal electrical component used to store electrical energy temporarily in an electric field.; DIGIKEY_PART: 490-11384-1-ND; MANUFACTURER: Murata; MANU_PART: GRM1555C1H270JA; PROD_ID: CAP-15357
C24 = SparkFun-Capacitors:15PF: 15pF ceramic capacitors A capacitor is a passive two-terminal electrical component used to store electrical energy temporarily in an electric field.; PROD_ID: CAP-07881
C53 C54 = SparkFun-Capacitors:1.0UF: 1µF ceramic capacitors A capacitor is a passive two-terminal electrical component used to store electrical energy temporarily in an electric field.; PROD_ID: CAP-13930
D1 = SparkFun-DiscreteSemi:DIODE-ZENER: Zener Diode A Zener diode allows current to flow from its anode to its cathode like a normal semiconductor diode, but it also permits current to flow in the reverse direction when its "Zener voltage" is reached. - WIkipedia; PROD_ID: DIO-11284
D2 = SparkFun-LED:LED-RED: Red SMD LED Used in manufacturing of most products at SparkFun Packages: 0603 - SMD 0603 package [Product Link] <http://docs.avagotech.com/docs/AV02-0551EN> 0603 SMART - SMD 0603 SMART package ( more efficient and expensive)[Product Link] <http://www.osram-os.com/Graphics/XPic2/00077099_0.pdf> 1206 - SMD1206 package [Product Link] <https://www.sparkfun.com/datasheets/DevTools/LilyPad/Q150OVS4.pdff> SparkFun Products: Pro Mini 328 -5V <https://www.sparkfun.com/products/821> RedBoard <https://www.sparkfun.com/products/12757> IOIO-OTG <https://www.sparkfun.com/products/13613>; PROD_ID: DIO-00819
D3 = SparkFun-DiscreteSemi:DIODE-SCHOTTKY-DUAL: Diodes Incorporated - BAS70-05 Dual Schottky Diode Two Schottky Diodes in a single SOT-23 package. Low reverse current (100 nA) Vf: Datasheet referenced for footprint <https://www.diodes.com/assets/Datasheets/ds11007.pdf>; PROD_ID: DIO-14829
D4 D5 = SparkFun-LED:LED-YELLOW: Yellow SMD LED Used in manufacturing several products at SparkFun. Packages: 0603 - SMD 0603 package[Product Link] <http://www.kingbrightusa.com/product.asp?catalog_name=LED&product_id=APT1608SYCK> 0603 -SMART - SMART SMD 0603 package (more efficient/more expensive) [Product Link] <http://www.osram-os.com/osram_os/en/products/product-catalog/led-light-emitting-diodes/smartled-0603/ly-l29k/index.jsp> LilyPad - SMD1206 package[Product Datasheet] <https://www.sparkfun.com/datasheets/DevTools/LilyPad/Q150YUS4.pdf> SparkFun Products: Blynk Board <https://www.sparkfun.com/products/13794> IOIO-OTG <https://www.sparkfun.com/products/13613> XBee Explorer Serial <https://www.sparkfun.com/products/13225>; PROD_ID: DIO-09003
D6 = SparkFun-DiscreteSemi:DIODE-SCHOTTKY: Schottky diode A Schottky diode is a semiconductor diode which has a low forward voltage drop and a very fast switching action.; PROD_ID: DIO-14072
D7 = SparkFun-DiscreteSemi:DIODE-SCHOTTKY: Schottky diode A Schottky diode is a semiconductor diode which has a low forward voltage drop and a very fast switching action.; PROD_ID: DIO-15271
D8 = ublox:TVS_DIODE_ARRAY_4; PROD_ID: DIO-14095
D10 D11 = New_Parts:PESD0402: ESD protection diode PESD is used to protect a signal line from ESD.; DIGIKEY_PART: PESD0402-140CT-ND; MOUSE_PART: 650-PESD0402-140; PROD_ID: DIO-15359
D12 = SparkFun-LED:LED-GREEN: Green SMD LED Used in manufacturing of various products at SparkFun Packages: 0603 - SMD 0603 package [Product Link] <http://www.futureelectronics.com/en/technologies/semiconductors/optoelectronics/leds/Pages/9894312-LTST-C190GKT.aspx?CrossPart=HSMG-C190&IM=0> LilyPad 1206 - SMD1206 LilyPad package [Product Link] <http://www.futureelectronics.com/en/Technologies/Product.aspx?ProductID=IN150NGHARVATEKCORPORATION2049943&IM=0> 1206 - SMD1206 package [Product Link] <http://www.futureelectronics.com/en/technologies/semiconductors/optoelectronics/leds/Pages/8315665-LTST-C150KGKT.aspx?IM=0> 1206 Bottom Mount -SMD 1206 Bottom Mount [Product Link] <http://www.digikey.com/product-detail/en/lite-on-inc/LTST-C230KGKT/160-1456-1-ND/386854> SparkFun Products: Pro Mini 328 -5V <https://www.sparkfun.com/products/821> RedBoard <https://www.sparkfun.com/products/12757> MP3 Trigger <https://www.sparkfun.com/products/13720> Makey Makey <https://www.sparkfun.com/products/11076>; PROD_ID: DIO-00821
D13 = SparkFun-LED:LED-BLUE: Blue SMD LED Used in manufacturing of various products at SparkFun Packages: 0603 - SMD 0603 package [Product Link] <http://www.digikey.com/product-detail/en/SMLE12BC7TT86/511-1589-2-ND/1641808> 1206 - SMD1206 package [Product Link] <http://www.digikey.com/product-detail/en/lite-on-inc/LTST-C150TBKT/160-1643-1-ND/573584> SparkFun Products: ESP8266 Thing-Dev Board <https://www.sparkfun.com/products/13711> RedBoard <https://www.sparkfun.com/products/12757>; PROD_ID: DIO-08575
D14 = SparkFun-LED:LED-WHITE: White SMD LED Used in manufacturing several products at SparkFun. Packages: 0603 - Bright White SMD 0603 package[Product Link] <http://www.kingbrightusa.com/product.asp?catalog_name=LED&product_id=APT1608QWF/D> 1206 - Bright White SMD1206 package [Product Link] <http://www.kingbrightusa.com/product.asp?catalog_name=LED&product_id=APT3216QWF/D> 3014 - Super Bright SMD 3014 package [Datasheet] <http://www.lumileds.com/uploads/459/DS208-pdf> SparkFun Products: Blackberry Trackballer Breakout <https://www.sparkfun.com/products/13169> Digital SandBox <https://www.sparkfun.com/products/12651>; PROD_ID: DIO-09004
DSR JP19 = SparkFun-Jumpers:JUMPER-SMT_3_1-NC_TRACE: Normally closed trace jumper (1 of 2 connections) This jumper has a trace between two pads so it's normally closed (NC). The other connection is normally open (NO). Use a razor knife to open the connection. For best results follow the IPC guidelines for cutting traces: Cutout at least 0.063 mm (0.005 in). Remove all loose material to clean up the cut area. Seal the cut with an approved epoxy. Reapply solder to reclose the connection, or to close the NO connection.
E1 = SparkFun-Sensors:SPH0641LM4H-1_MICROPHONE: SPH0641LM4H-1 Microphone A miniature, high-performance, low power, bottom port silicon digital microphone with a single bit PDM output.; PROD_ID: IC-14361
E3 E4 = SparkFun-RF:ANTENNA-SMA-GROUNDED: SMA Antenna Connector w/ Ground Edge-mount and SMD SMA connectors for RF Antennas. **4-LAYER BOARD WARNING!!** When designing a 4-layer board using any of the SMD variants, you will need to manually add a cutout polygon on any internal power layers to make sure that you don't end up with exposed copper around the edge of the routed hole for these connectors. Exposed power copper could then short to the connector body - and that would be bad. Why hasn't anyone added the cutout polygons directly to the connector footprint? Well, your internal layers (usually 2 and 15) may be covered with GND polygons and you might well want the copper to go all the way to the edge, especially under the connector SIGNAL pin. So adding cutouts to the footprint might make matters worse, not better...; PROD_ID: CONN-15100
F2 = SparkFun-Fuses:PPTC: Resettable Fuse PPTC Resettable Fuse. Really a sort of resistor with a polymeric positive temperature coefficient whose resistance increases dramatically with an increase in temperature. When heated by the power passing through the resistance rises causing the current to be limited, protecting the circuit. This is achieved by the transition of the polymer from a crystalline to an amorphous state where the conductive carbon separates breaking the conductive pathways found in the cool crystalline structure. When a PPTC cools back down it resumes conducting letting the circuit turn back on. SparkFun Products: SparkFun RedBoard - Programmed with Arduino <https://www.sparkfun.com/products/12757> Pro Micro - 5V/16MHz <https://www.sparkfun.com/products/12640> Arduino Pro 328 - 5V/16MHz <https://www.sparkfun.com/products/10915> MP3 Trigger <https://www.sparkfun.com/products/13720>; PROD_ID: RES-14313
FB1 = SparkFun-Coils:FERRITE_BEAD: Ferrite Bead (blocks, cores, rings, chokes, etc.) Inductor with layers of ferrite used to suppress high frequencies. Often used to isolate high frequency noise. SparkFun Products: IOIO-OTG - V2.2 <https://www.sparkfun.com/products/13613> SparkFun SAMD21 Mini Breakout <https://www.sparkfun.com/products/13664> SparkFun 6 Degrees of Freedom Breakout - LSM6DS3 <https://www.sparkfun.com/products/13339> SparkFun SAMD21 Dev Breakout <https://www.sparkfun.com/products/13672>; PROD_ID: NDUC-13805
FD1-FD4 = SparkFun-Aesthetics:FIDUCIAL: Fiducial Alignment Points Point-of-reference for pick-and-place machines and other optical instruments.
FRAME1 FRAME2 = SparkFun-Aesthetics:FRAME-LEDGER: Schematic Frame - Ledger Standard 11x14 US Ledger frame
H1-H4 = SparkFun-Hardware:STAND-OFF: Stand Off Drill holes for mechanically mounting via screws, standoffs, etc. Note: Use the keepout ring to avoid running the screw head into surrounding components. Variant Overviews STAND-OFF - Mechanical footprint for a #4 phillips button head screw. STAND-OFF-TIGHT - Mechanical footprint for a #4 phillips button head screw, Example SparkFun Products Screw - Phillips Head (1/4", 4-40, 10 pack) <https://www.sparkfun.com/products/10453> (PRT-10453) Screw - Phillips Head (1/2", 4-40, 10 pack) <https://www.sparkfun.com/products/10452> (PRT-10452) Screw - Phillips Head (3/4", 4-40, 10 pack) <https://www.sparkfun.com/products/10451> (PRT-10451) Screw - Phillips Head (1", 4-40, 10 pack) <https://www.sparkfun.com/products/10450> (PRT-10450)
H5 = SparkFun-Hardware:STAND-OFF-REFLOW: Stand Off Reflow Compatible A metal standoff that can be placed and reflowed onto a PCB.; PROD_ID: HW-14899
IC1-IC3 = New_Parts:SN74AVC4T774PW: Texas Instruments,SN74AVC4T774PW,IC, Texas Instruments SN74AVC4T774PW, Dual, Bus Transceiver, 4-Bit Non-Inverting 3-State, 1.2 3.6 V, 16-Pin TSSOP Source: Datasheet <http://www.ti.com/lit/ds/symlink/sn74avc4t774.pdf>; ARROW_PART_NUMBER: SN74AVC4T774PW; ARROW_PRICE-STOCK: https://www.arrow.com/en/products/sn74avc4t774pw/texas-instruments; DESCRIPTION: Texas Instruments,SN74AVC4T774PW,IC, Texas Instruments SN74AVC4T774PW, Dual, Bus Transceiver, 4-Bit Non-Inverting 3-State, 1.2 3.6 V, 16-Pin TSSOP; MANUFACTURER_NAME: Texas Instruments; MANUFACTURER_PART_NUMBER: SN74AVC4T774PW; MOUSER_PART_NUMBER: 595-SN74AVC4T774PW; MOUSER_PRICE-STOCK: https://www.mouser.co.uk/ProductDetail/Texas-Instruments/SN74AVC4T774PW?qs=WxL8HmPi5r44hV1AE7gRvg%3D%3D; PROD_ID: IC-15360
J1 = SparkFun-Connectors:USB_C: USB Type C 16Pin Connector Super Speed pins not available on the 16-pin purely SMD connector so this part is best for USB 2.0 implementations. D1 and D2 are tied together enabling D+/- no matter which way the cable is plugged into the connector. The two channel configuration pins (CC1/2) are exposed. These are normally connected to ground via 5.1k resistors but can be reconfigured for high current/high power applications. **4-LAYER BOARD WARNING!!** If designing 4-layer board, make sure to select the variant _4-LAYER-ISOLATED. The linked footprint (USB-C-16-4LAYER-ISOLATED) includes some very necessary cutout polygons in the inner layers (2 and 15). This prevents the PTH mounting shield legs on the USB connector from electrically connecting any other polygons on the inner layers (usually VCC and GND).; PROD_ID: CONN-14122
J2 = SparkFun-Connectors:CORTEX_JTAG_DEBUG_MINIMUM: Cortex Debug Connector - 10 pin Supports JTAG debug, Serial Wire debug, and Serial Wire Viewer. PTH and SMD connector options available. General Connector Information <http://infocenter.arm.com/help/topic/com.arm.doc.faqs/attached/13634/cortex_debug_connectors.pdf> Products: PTH Connector <http://www.digikey.com/product-detail/en/cnc-tech/3220-10-0100-00/1175-1627-ND/3883661> -via Digi-Key SparkFun PSoc <https://www.sparkfun.com/products/13229> SparkFun T <https://www.sparkfun.com/products/13810>
J4 = SparkFun-MicroMod:MICROMOD: MicroMod Connector Description: A card edge connector and mating PCB connector to allow various MicroMod Processor Boards to be coupled with various carrier boards of different capabilities. Based on the M.2 standard.; PROD_ID: CONN-14877
J5 J6 = SparkFun-Connectors:CONN_05: Multi connection point. Often used as Generic Header-pin footprint for 0.1 inch spaced/style header connections On any of the 0.1 inch spaced packages, you can populate with these: Break Away Headers - Straight <https://www.sparkfun.com/products/116> (PRT-00116) Break Away Male Headers - Right Angle <https://www.sparkfun.com/products/553> (PRT-00553) Female Headers <https://www.sparkfun.com/products/115> (PRT-00115) Break Away Headers - Machine Pin <https://www.sparkfun.com/products/117> (PRT-00117) Break Away Female Headers - Swiss Machine Pin <https://www.sparkfun.com/products/743> (PRT-00743) For SCREWTERMINALS and SPRING TERMINALS visit here: Screw Terimnals on SparkFun.com <https://www.sparkfun.com/search/results?term=Screw+Terminals> (5mm/3.5mm/2.54mm spacing) This device is also useful as a general connection point to wire up your design to another part of your project. Our various solder wires solder well into these plated through hole pads. Hook-Up Wire - Assortment (Stranded, 22 AWG) <https://www.sparkfun.com/products/11375> (PRT-11375) Hook-Up Wire - Assortment (Solid Core, 22 AWG) <https://www.sparkfun.com/products/11367> (PRT-11367) View the entire wire category on our website here <https://www.sparkfun.com/categories/141> Special notes: Molex polarized connector foot print use with SKU : PRT-08231 with associated crimp pins and housings. 1MM SMD Version SKU: PRT-10208
J7 = SparkFun-Connectors:QWIIC_CONNECTOR: SparkFun I2C Standard Qwiic Connector An SMD 1mm pitch JST connector makes it easy and quick (get it? Qwiic?) to connect I2C devices to each other. The Qwiic system <http://www.sparkfun.com/qwiic> enables fast and solderless connection between popular platforms and various sensors and actuators. We carry 200mm <https://www.sparkfun.com/products/14204>, 100mm <https://www.sparkfun.com/products/14205>, 50mm <https://www.sparkfun.com/products/14206>, and breadboard friendly <https://www.sparkfun.com/products/14207> Qwiic cables. We also offer 10 pcs strips <https://www.sparkfun.com/products/14323> the SMD connectors.; PROD_ID: CONN-13694
J8 J10 = SparkFun-Connectors:CONN_06: Multi connection point. Often used as Generic Header-pin footprint for 0.1 inch spaced/style header connections On any of the 0.1 inch spaced packages, you can populate with these: Break Away Headers - Straight <https://www.sparkfun.com/products/116> (PRT-00116) Break Away Male Headers - Right Angle <https://www.sparkfun.com/products/553> (PRT-00553) Female Headers <https://www.sparkfun.com/products/115> (PRT-00115) Break Away Headers - Machine Pin <https://www.sparkfun.com/products/117> (PRT-00117) Break Away Female Headers - Swiss Machine Pin <https://www.sparkfun.com/products/743> (PRT-00743) Arduino Stackable Header - 6 Pin <https://www.sparkfun.com/products/9280> (PRT-09280) For SCREWTERMINALS and SPRING TERMINALS visit here: Screw Terimnals on SparkFun.com <https://www.sparkfun.com/search/results?term=Screw+Terminals> (5mm/3.5mm/2.54mm spacing) This device is also useful as a general connection point to wire up your design to another part of your project. Our various solder wires solder well into these plated through hole pads. Hook-Up Wire - Assortment (Stranded, 22 AWG) <https://www.sparkfun.com/products/11375> (PRT-11375) Hook-Up Wire - Assortment (Solid Core, 22 AWG) <https://www.sparkfun.com/products/11367> (PRT-11367) View the entire wire category on our website here <https://www.sparkfun.com/categories/141>
J9 J13 J19 = SparkFun-Connectors:CONN_01: Single connection point. Often used as Generic Header-pin footprint for 0.1 inch spaced/style header connections On any of the 0.1 inch spaced packages, you can populate with these: Break Away Headers - Straight <https://www.sparkfun.com/products/116> (PRT-00116) Break Away Male Headers - Right Angle <https://www.sparkfun.com/products/553> (PRT-00553) Female Headers <https://www.sparkfun.com/products/115> (PRT-00115) Break Away Headers - Machine Pin <https://www.sparkfun.com/products/117> (PRT-00117) Break Away Female Headers - Swiss Machine Pin <https://www.sparkfun.com/products/743> (PRT-00743) This device is also useful as a general connection point to wire up your design to another part of your project. Our various solder wires solder well into these plated through hole pads. Hook-Up Wire - Assortment (Stranded, 22 AWG) <https://www.sparkfun.com/products/11375> (PRT-11375) Hook-Up Wire - Assortment (Solid Core, 22 AWG) <https://www.sparkfun.com/products/11367> (PRT-11367) View the entire wire category on our website here <https://www.sparkfun.com/categories/141> Special notes: SMTSO-256-ET is a "flush mount" nut for a 4-40 screw. We mostly use this on specialty testbeds; it is a nice way to connect hardware to your PCB at an adjustable hieght. Also note, the SNAP packages are for using a snappable style connector. We sell a baggie of snaps and they are also used on two LilyPad designs: Snap Assortment - 30 pack (male and female) <https://www.sparkfun.com/products/11347> (DEV-11347) LilyPad Arduino SimpleSnap <https://www.sparkfun.com/products/10941> (DEV-10941) LilyPad SimpleSnap Protoboard <https://www.sparkfun.com/products/10940> (DEV-10940)
J11 = SparkFun-Connectors:MICRO-SD-SDIO: microSD Socket for Transflash Push-push type µSD socket. tDoc lines correctly indicate media card edge positions when inserting (unlocked, locked, depressed). NOTE: CD1 and CD2 are connected internally, and the default detect state of the socket is detect pin to ground. SparkFun Products: WAV Trigger <https://www.sparkfun.com/products/13660> CAN-Bus Shield <https://www.sparkfun.com/products/13262> SparkFun Level Shifing microSD Breakout <https://www.sparkfun.com/products/13743>; PROD_ID: CONN-07820
J12 J14 = SparkFun-Connectors:I2C_STANDARD: SparkFun I2C Standard Pinout Header SparkFun has standardized on a pinout for all I2C based sensor breakouts. This pinout allows I2C boards to be plugged directly into the headers on Arduino Uno compatible boards, and to be daisy chained easily. Example SparkFun Products: SparkFun Atmospheric Sensor Breakout - BME280 <https://www.sparkfun.com/products/13676> SparkFun Altitude/Pressure Sensor Breakout - MPL3115A2 <https://www.sparkfun.com/products/11084> SparkFun TOF Range Finder Sensor - VL6180 <https://www.sparkfun.com/products/12785>
J15 = SparkFun-Connectors:JST_2MM_MALE: JST 2MM MALE RA CONNECTOR Two pin, compact surface mount connector. Commonly used as a battery input connection point. We really like the solid locking feeling and high current rating on these small connectors. We use these all the time as battery connectors. Mates to single-cell LiPo batteries. Here is the connector we sell at SparkFun: JST Right Angle Connector - White <https://www.sparkfun.com/products/8612> (PRT-08612) Datasheet <http://www.sparkfun.com/datasheets/Prototyping/Connectors/JST-Horizontal.pdf> It was used on these SparkFun products: SparkFun MOSFET Power Controller <https://www.sparkfun.com/products/11214> (PRT-11214) SparkFun Battery Babysitter - LiPo Battery Manager <https://www.sparkfun.com/products/13777> (PRT-13777) And many, many others that required a lipo battery connection.; PROD_ID: CONN-11443; SF_ID: PRT-08612
J16 = SparkFun-Connectors:CONN_02: Multi connection point. Often used as Generic Header-pin footprint for 0.1 inch spaced/style header connections On any of the 0.1 inch spaced packages, you can populate with these: Break Away Headers - Straight <https://www.sparkfun.com/products/116> (PRT-00116) Break Away Male Headers - Right Angle <https://www.sparkfun.com/products/553> (PRT-00553) Female Headers <https://www.sparkfun.com/products/115> (PRT-00115) Break Away Headers - Machine Pin <https://www.sparkfun.com/products/117> (PRT-00117) Break Away Female Headers - Swiss Machine Pin <https://www.sparkfun.com/products/743> (PRT-00743) For SCREWTERMINALS and SPRING TERMINALS visit here: Screw Terimnals on SparkFun.com <https://www.sparkfun.com/search/results?term=Screw+Terminals> (5mm/3.5mm/2.54mm spacing) This device is also useful as a general connection point to wire up your design to another part of your project. Our various solder wires solder well into these plated through hole pads. Hook-Up Wire - Assortment (Stranded, 22 AWG) <https://www.sparkfun.com/products/11375> (PRT-11375) Hook-Up Wire - Assortment (Solid Core, 22 AWG) <https://www.sparkfun.com/products/11367> (PRT-11367) View the entire wire category on our website here <https://www.sparkfun.com/categories/141> Special notes: Molex polarized connector foot print use with: PRT-08233 with associated crimp pins and housings. 2.54_SCREWTERM for use with PRT-10571. 3.5mm Screw Terminal footprints for PRT-08084 5mm Screw Terminal footprints for use with PRT-08432
J17 = ublox:NANO_SIM; PROD_ID: CONN-14097
J18 = SparkFun-Connectors:CONN_04: Multi connection point. Often used as Generic Header-pin footprint for 0.1 inch spaced/style header connections On any of the 0.1 inch spaced packages, you can populate with these: Break Away Headers - Straight <https://www.sparkfun.com/products/116> (PRT-00116) Break Away Male Headers - Right Angle <https://www.sparkfun.com/products/553> (PRT-00553) Female Headers <https://www.sparkfun.com/products/115> (PRT-00115) Break Away Headers - Machine Pin <https://www.sparkfun.com/products/117> (PRT-00117) Break Away Female Headers - Swiss Machine Pin <https://www.sparkfun.com/products/743> (PRT-00743) For SCREWTERMINALS and SPRING TERMINALS visit here: Screw Terimnals on SparkFun.com <https://www.sparkfun.com/search/results?term=Screw+Terminals> (5mm/3.5mm/2.54mm spacing) This device is also useful as a general connection point to wire up your design to another part of your project. Our various solder wires solder well into these plated through hole pads. Hook-Up Wire - Assortment (Stranded, 22 AWG) <https://www.sparkfun.com/products/11375> (PRT-11375) Hook-Up Wire - Assortment (Solid Core, 22 AWG) <https://www.sparkfun.com/products/11367> (PRT-11367) View the entire wire category on our website here <https://www.sparkfun.com/categories/141> Special notes: Molex polarized connector foot print use with SKU : PRT-08231 with associated crimp pins and housings. 1MM SMD Version SKU: PRT-10208; PROD_ID: CONN-09696
JP1 JP2 = SparkFun-Jumpers:JUMPER-SMT_3_2-NC_TRACE: Normally closed trace jumper (2 of 2 connections) This jumper has a trace between all three pads so they are normally closed (NC). Use a razor knife to open the connection(s). For best results follow the IPC guidelines for cutting traces: Cutout at least 0.063 mm (0.005 in). Remove all loose material to clean up the cut area. Seal the cut with an approved epoxy. Reapply solder to reclose the connection(s).
L1 = New_Parts:INDUCTOR_DNP
L2 = New_Parts:68NH; DIGIKEY_PART: 490-2633-1-ND; MOUSER_PART: 81-LQG15HS68NJ02D; PROD_ID: NDUC-15356
LOGO1 = SparkFun-Aesthetics:SFE_LOGO_NAME_FLAME: SparkFun Font Logo w/ Flame This is the SparkFun full logo. The logo on the schematic will always be the same size; the package variant is the height of the flame part of the logo. Default layer for the logo on the board is tSilk.
LOGO2 = SparkFun-Aesthetics:QWIIC_LOGO: Qwiic Logos for placement on schematic and PCB. The 5.5mm silk logo is best for placing next to Qwiic connector.
LOGO3 = SparkFun-Aesthetics:OSHW-LOGO: Open-Source Hardware (OSHW) Logo This logo indicates the piece of hardware it is found on incorporates a OSHW license and/or adheres to the definition of open source hardware found here: http://freedomdefined.org/OSHW
LOGO5 = SparkFun-Aesthetics:SPECIAL_INSTRUCTIONS: Special Ordering/Production Instructions Alert Symbol for special PCB ordering instructions or unique production process warnings. Ordering Instructions Production Instructions Types of information that should be added to box: Copper weight Soldermask color Silk color PCB thickness Number of layers PCB Standard: 1.6mm FR4 1 oz copper immersion silver plating red soldermask white silkscreen Types of information that should be added to box: Special wash requirements Depaneling instructions Humidification Glue curing Default text settings: 0.07 inch 9% ratio 50% line distance
MEAS = SparkFun-Jumpers:JUMPER-COMBO_2_NC_TRACE
Q1-Q4 Q7-Q9 = SparkFun-DiscreteSemi:MOSFET-NCH: N-channel MOSFETs Voltage controlled devices that allow control of high current outputs. SparkFun Products: SparkFun OpenScale <https://www.sparkfun.com/products/13261> SparkFun Digital Sandbox <https://www.sparkfun.com/products/12651> SparkFun Monster Moto Shield <https://www.sparkfun.com/products/10182> SparkFun MOSFET Power Controller <https://www.sparkfun.com/products/11214>; PROD_ID: TRANS-11151
Q5 Q10 = SparkFun-DiscreteSemi:MOSFET-NCH: N-channel MOSFETs Voltage controlled devices that allow control of high current outputs. SparkFun Products: SparkFun OpenScale <https://www.sparkfun.com/products/13261> SparkFun Digital Sandbox <https://www.sparkfun.com/products/12651> SparkFun Monster Moto Shield <https://www.sparkfun.com/products/10182> SparkFun MOSFET Power Controller <https://www.sparkfun.com/products/11214>; PROD_ID: TRANS-14399
Q6 = SparkFun-DiscreteSemi:MOSFET_PCH: P-channel MOSFETs Voltage controlled devices that allow control of high current outputs. SparkFun Products: SparkFun ESP32 Thing <https://www.sparkfun.com/products/13907> SparkFun ESP8266 Thing <https://www.sparkfun.com/products/13231> SparkFun Pi Servo HAT V2 <https://www.sparkfun.com/products/15316> DMG2305UX-7 (20V/4.2A/SOT23-3); PROD_ID: TRAN-14388
R1 R4 R7 R12 R14 R22 R29 R30 R48 = SparkFun-Resistors:2.2KOHM: 2.2kΩ resistor A resistor is a passive two-terminal electrical component that implements electrical resistance as a circuit element. Resistors act to reduce current flow, and, at the same time, act to lower voltage levels within circuits. - Wikipedia; PROD_ID: RES-08272
R2 R3 = SparkFun-Resistors:5.1KOHM; PROD_ID: RES-12083
R5 R15-R20 R25 R38-R41 R44 R45 = SparkFun-Resistors:100KOHM: 100kΩ resistor A resistor is a passive two-terminal electrical component that implements electrical resistance as a circuit element. Resistors act to reduce current flow, and, at the same time, act to lower voltage levels within circuits. - Wikipedia; PROD_ID: RES-07828
R6 = SparkFun-Resistors:4.7KOHM: 4.7kΩ resistor A resistor is a passive two-terminal electrical component that implements electrical resistance as a circuit element. Resistors act to reduce current flow, and, at the same time, act to lower voltage levels within circuits. - Wikipedia; PROD_ID: RES-07857
R8 = SparkFun-Resistors:3.3KOHM: 3.3kΩ resistor A resistor is a passive two-terminal electrical component that implements electrical resistance as a circuit element. Resistors act to reduce current flow, and, at the same time, act to lower voltage levels within circuits. - Wikipedia; PROD_ID: RES-07851
R9 R23 = SparkFun-Resistors:10KOHM: 10kΩ resistor A resistor is a passive two-terminal electrical component that implements electrical resistance as a circuit element. Resistors act to reduce current flow, and, at the same time, act to lower voltage levels within circuits. - Wikipedia; PROD_ID: RES-00824
R10 = SparkFun-Resistors:20KOHM: 20kΩ resistor A resistor is a passive two-terminal electrical component that implements electrical resistance as a circuit element. Resistors act to reduce current flow, and, at the same time, act to lower voltage levels within circuits. - Wikipedia; PROD_ID: RES-09383
R11 R13 R21 R27 R28 R32 R34 R42 R43 = SparkFun-Resistors:1KOHM: 1kΩ resistor A resistor is a passive two-terminal electrical component that implements electrical resistance as a circuit element. Resistors act to reduce current flow, and, at the same time, act to lower voltage levels within circuits. - Wikipedia; PROD_ID: RES-07856
R24 = SparkFun-Resistors:10OHM: 10Ω resistor A resistor is a passive two-terminal electrical component that implements electrical resistance as a circuit element. Resistors act to reduce current flow, and, at the same time, act to lower voltage levels within circuits. - Wikipedia; PROD_ID: RES-12581
R26 = SparkFun-Resistors:200KOHM: 200kΩ resistor A resistor is a passive two-terminal electrical component that implements electrical resistance as a circuit element. Resistors act to reduce current flow, and, at the same time, act to lower voltage levels within circuits. - Wikipedia; PROD_ID: RES-09385
R31 R36 R37 = SparkFun-Resistors:0OHM: 0Ω resistor A resistor is a passive two-terminal electrical component that implements electrical resistance as a circuit element. Resistors act to reduce current flow, and, at the same time, act to lower voltage levels within circuits. - Wikipedia; PROD_ID: RES-08609
R33 = SparkFun-Resistors:100OHM: 100Ω resistor A resistor is a passive two-terminal electrical component that implements electrical resistance as a circuit element. Resistors act to reduce current flow, and, at the same time, act to lower voltage levels within circuits. - Wikipedia; PROD_ID: RES-07863
R35 = SparkFun-Resistors:470OHM: 470Ω resistor A resistor is a passive two-terminal electrical component that implements electrical resistance as a circuit element. Resistors act to reduce current flow, and, at the same time, act to lower voltage levels within circuits. - Wikipedia; PROD_ID: RES-07869
S1-S3 = SparkFun-Switches:MOMENTARY-SWITCH-SPST: Momentary Switch (Pushbutton) - SPST Normally-open (NO) SPST momentary switches (buttons, pushbuttons). Variants PTH-12MM - 12mm square, through-hole Momentary Pushbutton Switch - 12mm Square <https://www.sparkfun.com/products/9190> (COM-09190) PTH-6.0MM, PTH-6.0MM-KIT - 6.0mm square, through-hole Mini Pushbutton Switch <https://www.sparkfun.com/products/97> (COM-00097) KIT package intended for soldering kit's - only one side of pads' copper is exposed. PTH-RIGHT-ANGLE-KIT - Right-angle, through-hole Right Angle Tactile Button <https://www.sparkfun.com/products/10791> - Used on SparkFun BigTime Watch Kit <https://www.sparkfun.com/products/11734> SMD-12MM - 12mm square, surface-mount Tactile Button - SMD (12mm) <https://www.sparkfun.com/products/12993> (COM-12993) Used on SparkFun PicoBoard <https://www.sparkfun.com/products/11888> SMD-4.5MM - 4.5mm Square Trackball Switch Used on SparkFun Blackberry Trackballer Breakout <https://www.sparkfun.com/products/13169> SMD-4.6MMX2.8MM - 4.60mm x 2.80mm, surface mount Used on SparkFun SAMD21 Mini Breakout <https://www.sparkfun.com/products/13664> SMD-5.2MM, SMD-5.2-REDUNDANT - 5.2mm square, surface-mount Mini Pushbutton Switch - SMD <https://www.sparkfun.com/products/8720> (COM-08720) Used on Arduino Pro Mini <https://www.sparkfun.com/products/11114> REDUNDANT package connects both switch circuits together SMD-6.0X3.5MM - 6.0 x 3.5mm, surface mount Momentary Reset Switch SMD <https://www.sparkfun.com/products/8229> (COM-08229) SMD-6.2MM-TALL - 6.2mm square, surface mount Tactile Button - SMD (6mm) <https://www.sparkfun.com/products/12992> Used on SparkFun Digital Sandbox <https://www.sparkfun.com/products/12651> SMD-RIGHT-ANGLE - Right-angle, surface mount Used on SparkFun Block for Intel® Edison - Arduino <https://www.sparkfun.com/products/13036>; PROD_ID: SWCH-14139
TP1-TP10 TP12-TP24 = SparkFun-Connectors:TEST-POINT: SparkFun Test Points Bare copper test points for troubleshooting or In-Circuit-Testing. These are used by our Production team for verifying production board runs using pogo-pins on test beds. SparkFun Products: SparkFun LSM9DS1 Breakout <https://www.sparkfun.com/products/13284> SparkFun PSOC <https://www.sparkfun.com/products/13714> SparkFun Load Cell Amplifier <https://www.sparkfun.com/products/13879>
U1 = SARA_R5:SARA-R510M8S; PROD_ID: IC-15573
U2 = SparkFun-IC-Power:MCP73831: MCP73831T Li-Ion, Li-Pol Controller Miniature single cell, fully integrated Li-Ion, Li-polymer charge management controller Datasheet <http://ww1.microchip.com/downloads/en/DeviceDoc/20001984g.pdf> SparkFun Products: SparkFun ESP32 Thing <https://www.sparkfun.com/products/13907> SparkFun 9DoF Razor IMU M0 <https://www.sparkfun.com/products/14001>; PROD_ID: IC-09995
U3 = SparkFun-IC-Power:V_REG_AP2112: AP2112 - 600mA CMOS LDO Regulator w/ Enable The AP2112 is CMOS process low dropout linear regulator with enable function, the regulator delivers a guaranteed 600mA (min.) continuous load current. Features Output Voltage Accuracy: ±1.5% Output Current: 600mA (Min.) Foldback Short Current Protection: 50mA Enable Function to Turn ON/OFF VOUT Low Dropout Voltage (3.3V): 250mV (Typ.) @IOUT=600mA Excellent Load Regulation: 0.2%/A (Typ.) Excellent Line Regulation: 0.02%/V (Typ.) Low Quiescent Current: 55μA (Typ.) Low Standby Current: 0.01μA (Typ.) Low Output Noise: 50μVRMS PSRR: 100Hz -65dB, 1kHz -65dB OTSD Protection Stable with 1.0μF Flexible Cap: Ceramic, Tantalum and Aluminum Electrolytic Operation Temperature Range: -40°C to 85°C ESD: MM 400V, HBM 4000V; PROD_ID: VREG-12457
U4 = SparkFun-IC-Power:MAX17048: Micropower 1-Cell Li+ ModelGauge SparkFun Products Qduino Mini <https://www.sparkfun.com/products/13614> (DEV-13614); PROD_ID: IC-12551
U5 = SparkFun-IC-Power:AP7361C-33FGE: AP7361C 3.3V LDO Regulator; PROD_ID: VREG-14094
U7 = SparkFun-IC-Comms:PCA9306: Bidirectional I2C level shifter Not compatible with all available part number pinout schemes- DOUBLE CHECK!!! Variants PCA9306DC and PSOP-8 are EOL. If your part has VREF as pin 1 then this is your variant. VSSOP_8PIN is not EOL. Datasheet <https://cdn.sparkfun.com/datasheets/BreakoutBoards/PCA9306DC.pdf> SparkFun Products SparkFun Inventor's Kit for RedBot <https://www.sparkfun.com/products/12649> (ROB-12649) SparkFun RedBot Basic Kit <https://www.sparkfun.com/products/13166> (ROB-13166) SparkFun Level Translator Breakout - PCA9306 <https://www.sparkfun.com/products/11955> (BOB-11955) SparkFun Block for Intel Edison - ADC <https://www.sparkfun.com/products/13770> (DEV-13770) SparkFun Block for Intel® Edison - Raspberry Pi B <https://www.sparkfun.com/products/13044> (DEV-13044) SparkFun RedBot Sensor - Accelerometer <https://www.sparkfun.com/products/12589> (SEN-12589); PROD_ID: IC-14450
U8 = SparkFun-IC-Logic:74*1G04: Single Inverter IC NOT GATE INVERTER SNGL 1IN SOT353 Supply: 1.65V to 5.5V Datasheet <http://diodes.com/datasheets/74LVC1G04.pdf> SparkFun Products SparkFun Stepoko <https://www.sparkfun.com/products/13899> (ROB-13899) SparkFun CryptoShield <https://www.sparkfun.com/products/13183> (DEV-13183) SparkFun LogicBlocks Kit <https://www.sparkfun.com/products/11006> (KIT-11006) SparkFun ArduMoto <https://www.sparkfun.com/products/9815> (DEV-09815); PROD_ID: COMP-08268
U13 = SparkFun-Sensors:ICM-20948: ICM-20948 9 Degree of Freedom IMU World’s lowest power 9-axis MotionTracking device that is ideally suited for smartphones, tablets, wearable sensors, and IoT applications. Includes onboard Digital Motion Processor to offload computations from the host processor Datasheet <https://cdn.sparkfun.com/assets/learn_tutorials/5/5/0/MPU9250REV1.0.pdf> SparkFun Products: SparkFun IMU Breakout - ICM-20948 <https://www.sparkfun.com/products/15182>; PROD_ID: IC-14247
U14 = SparkFun-IC-Power:V_REG_SP6214: Voltage Regulator - SP6214 SP6214 Series SC-70-5 Micropower SC-70 100 mA CMOS LDO Regulator Datasheet <https://www.exar.com/content/document.ashx?id=654> SparkFun Products: MP3 Trigger <https://www.sparkfun.com/products/13720> SparkFun Particle Sensor Breakout <https://www.sparkfun.com/products/14045>; PROD_ID: VREG-08428

## Net classes
0 default: width 0 mm, drill 0 mm
1 power: width 0.762 mm